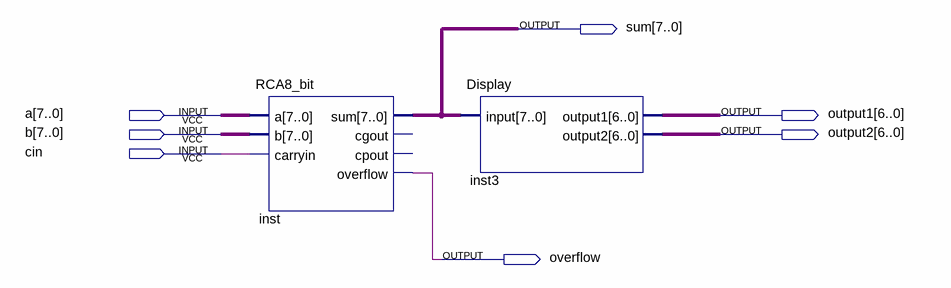
[diagram p0: schematic sheet]
// Quartus schematic Block1.bdf as structural Verilog: 2 symbols, 7 pins
module Block1 (
  input  [7:0] a,
  input  [7:0] b,
  input  cin,
  output [7:0] sum,
  output [6:0] output1,
  output [6:0] output2,
  output overflow
);

  RCA8_bit inst (.a(a), .b(b), .carryin(cin), .sum(sum), .overflow(overflow));  // open: cgout, cpout
  Display inst3 (.\input (sum), .output1(output1), .output2(output2));
endmodule
